# EAGLE design esp8266-proto-board-0805 (EAGLE 7.7.0)
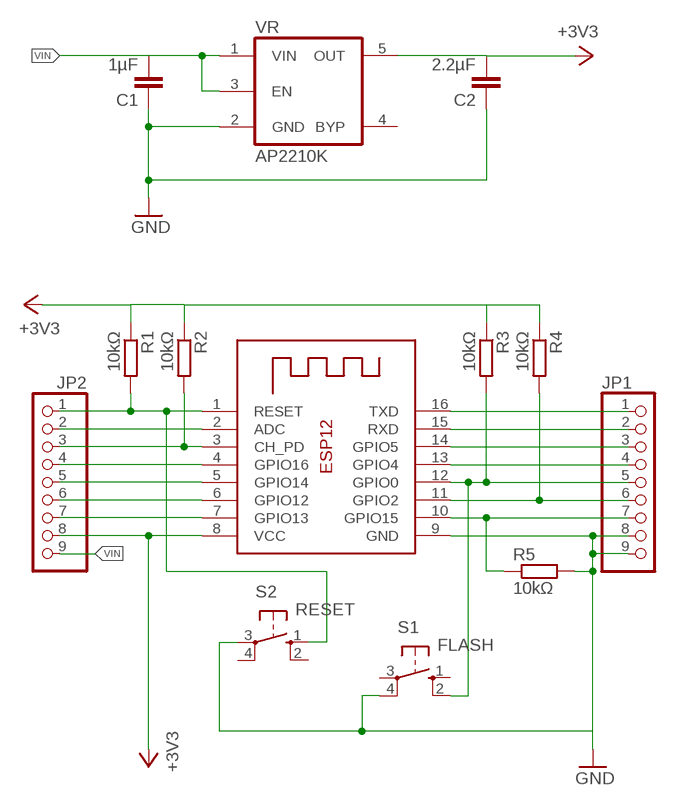
[diagram p0: schematic, sheet 1]

## Parts
C1  1µF  C-EUC0805K  [C0805K]
C2  2.2µF  C-EUC0805K  [C0805K]
JP1  PINHD-1X9  [1X09-BIG]
JP2  PINHD-1X9  [1X09-BIG]
R1  10kΩ  R-EU_R0805W  [R0805W]
R2  10kΩ  R-EU_R0805W  [R0805W]
R3  10kΩ  R-EU_R0805W  [R0805W]
R4  10kΩ  R-EU_R0805W  [R0805W]
R5  10kΩ  R-EU_R0805W  [R0805W]
S1  FLASH  10-XX  [B3F-10XX]
S2  RESET  10-XX  [B3F-10XX]
U1  ESP-12  [ESP-12]
VR  AP2210K  [SOT23-5]

## Nets
+3V3: C2.2 JP2.8 R1.1 R2.1 R3.1 R4.1 U1.8(VCC) VR.5(OUT)
ADC: JP2.2 U1.2(ADC)
CH_PD: JP2.3 R2.2 U1.3(CH_PD)
GND: C1.1 C2.1 JP1.8 JP1.9 R5.2 S1.4(P1) S2.3(P) U1.9(GND) VR.2(GND)
GPIO0: JP1.5 R3.2 S1.2(S1) U1.12(GPIO0)
GPIO2: JP1.6 R4.2 U1.11(GPIO2)
GPIO4: JP1.4 U1.13(GPIO4)
GPIO5: JP1.3 U1.14(GPIO5)
GPIO12: JP2.6 U1.6(GPIO12)
GPIO13: JP2.7 U1.7(GPIO13)
GPIO14: JP2.5 U1.5(GPIO14)
GPIO15: JP1.7 R5.1 U1.10(GPIO15)
GPIO16: JP2.4 U1.4(GPIO16)
RST: JP2.1 R1.2 S2.1(S) U1.1(RESET)
RX: JP1.2 U1.15(RXD)
TX: JP1.1 U1.16(TXD)
VIN: C1.2 JP2.9 VR.1(VIN) VR.3(EN)
Unconnected: S1.1(S) S1.3(P) S2.2(S1) S2.4(P1) VR.4(BYP)

## Library data of the parts
C1 C2 = rcl:C-EU: CAPACITOR, European symbol
JP1 JP2 = adafruit:PINHD-1X9: Pin header 1x10 0.1" spacing With round pins
R1-R5 = rcl:R-EU_: RESISTOR, European symbol
S1 S2 = switch-omron:10-XX: OMRON SWITCH; MPN: B3F-1000; OC_FARNELL: 176432; OC_NEWARK: 36M3542
U1 = adafruit:ESP-12
VR = diodes-inc:AP2210: LDO REGULATOR

## Board
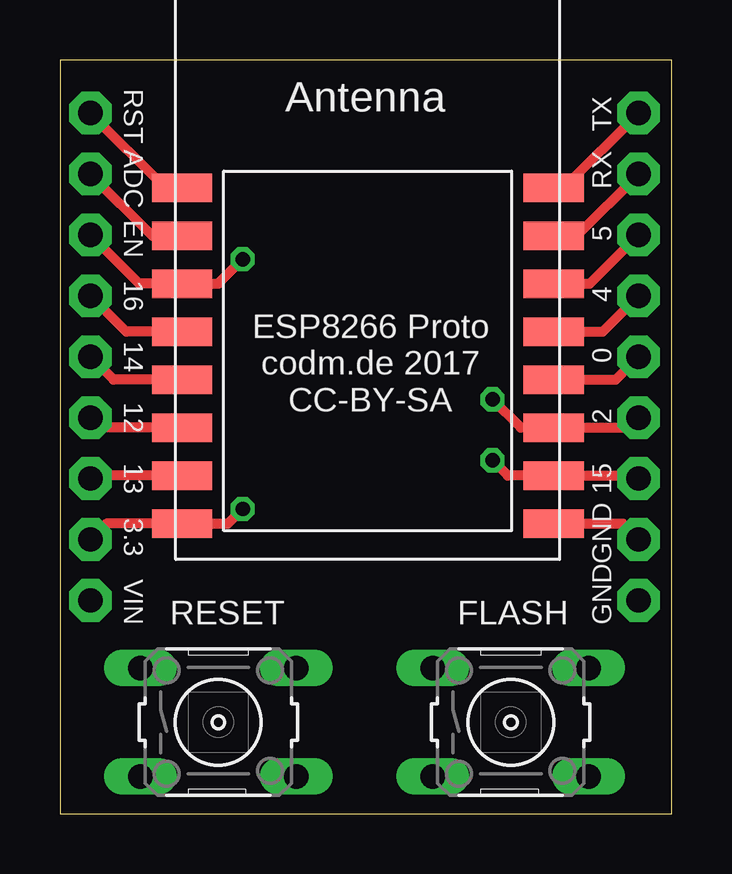
[diagram p1: board, top side]
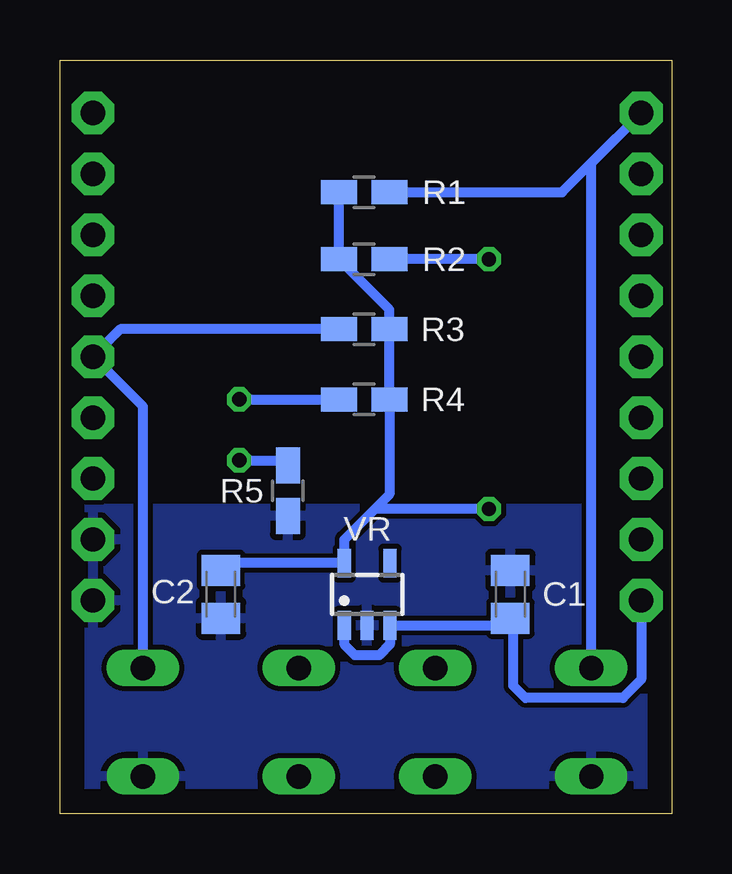
[diagram p2: board, bottom side, seen from below]

Size 25.51 x 31.42 mm. Coordinates in mm from the lower left corner, seen from the top.
Outline: 0,0 25.51,0 25.51,31.42 0,31.42 0,0
Copper layers (1*16): Top 0.035mm / dielectric 1.5mm / Bottom 0.035mm
Design rules "default": minimum track width 10mil, minimum drill 24mil, track to track 8mil, track to pad 8mil, pad to pad 8mil, via to via 8mil, smd to smd 8mil, copper to edge 40mil, drill to drill 8mil, minimum pad ring 10mil, minimum via ring 8mil, stop-mask expansion 4mil, vias tented up to drill 0mil, thermal gap 10mil

### Footprints (pad centres in the part's own frame; a part is rotated, then mirrored left to right if it is on the bottom)
C0805K = smd 1.3 x 1.6: 1 -1,0; 2 1,0
1X09-BIG = drill 1.016 pad 1.778 octagon: 1 -10.16,0; 2 -7.62,0; 3 -5.08,0; 4 -2.54,0; 5 0,0; 6 2.54,0; 7 5.08,0; 8 7.62,0; 9 10.16,0
R0805W = smd 1.5 x 1: 1 -1.052,0; 2 1.052,0
B3F-10XX = drill 1.016 long: 1 -3.251,2.261; 2 3.251,2.261; 3 -3.251,-2.261; 4 3.251,-2.261
ESP-12 = smd 2.508 x 1.2: 1 -7.729,4.5; 2 -7.729,2.5; 3 -7.729,0.5; 4 -7.729,-1.5; 5 -7.729,-3.5; 6 -7.729,-5.5; 7 -7.729,-7.5; 8 -7.729,-9.5; 9 7.754,-9.5; 10 7.754,-7.5; 11 7.754,-5.5; 12 7.754,-3.5; 13 7.754,-1.5; 14 7.754,0.5; 15 7.754,2.5; 16 7.754,4.5
SOT23-5 = smd 0.55 x 1.2: 1 -0.95,-1.3; 2 0,-1.3; 3 0.95,-1.3; 4 0.95,1.3; 5 -0.95,1.3

### Placement (x,y rotation side)
C1  6.73,9.14 270 bottom
C2  18.8,9.14 90 bottom
JP1  24.13,19.05 270 top
JP2  1.27,19.05 270 top
R1  12.83,25.91 0 bottom
R2  12.83,23.11 0 bottom
R3  12.83,20.19 180 bottom
R4  12.83,17.27 180 bottom
R5  16,13.46 270 bottom
S1  18.8,3.81 0 top
S2  6.6,3.81 0 top
U1  12.83,21.59 0 top
VR  12.7,9.14 0 bottom

### Tracks (layer width: path | path; a pad name or v marks a point on that pad's centre or on a via)
+3V3  (via drill 0.6)
  Top 0.406: JP2.8 1.93,12.09 U1.8 7.01,12.09 v7.62,12.7
  Bottom 0.406: R1.1 R2.1 11.77,21.01 R3.1 R4.1 11.77,13.31 12.38,12.7 | 12.38,12.7 13.65,11.43 VR.5 18.5,10.44 C2.2 | v7.62,12.7 12.38,12.7
ADC
  Top 0.406: U1.2 3.85,24.09 JP2.2
CH_PD  (via drill 0.6)
  Top 0.406: JP2.3 3.31,22.09 U1.3 6.6,22.09 v7.62,23.11
  Bottom 0.406: v7.62,23.11 R2.2
GND
  Top 0.406: U1.9 23.47,12.09 JP1.8
  pour Bottom: 0,12.7 25.4,12.7 25.4,0 0,0
GPIO0
  Top 0.406: U1.12 23.17,18.09 JP1.5
  Bottom 0.406: R3.2 22.99,20.19 JP1.5 22.05,16.97 S1.2
GPIO2  (via drill 0.6)
  Top 0.406: JP1.6 23.71,16.09 U1.11 19.22,16.09 v18.03,17.27
  Bottom 0.406: v18.03,17.27 R4.2
GPIO4
  Top 0.406: U1.13 22.63,20.09 JP1.4
GPIO5
  Top 0.406: U1.14 22.09,22.09 JP1.3
GPIO12
  Top 0.406: U1.6 1.69,16.09 JP2.6
GPIO13
  Top 0.406: U1.7 1.39,14.09 JP2.7
GPIO14
  Top 0.406: U1.5 2.23,18.09 JP2.5
GPIO15  (via drill 0.6)
  Top 0.406: JP1.7 24.01,14.09 U1.10 18.68,14.09 v18.03,14.73
  Bottom 0.406: v18.03,14.73 16.22,14.73 R5.1
GPIO16
  Top 0.406: U1.4 2.77,20.09 JP2.4
RST
  Top 0.406: U1.1 4.39,26.09 JP2.1
  Bottom 0.406: 3.3,27.18 JP2.1 | S2.1 3.35,27.13 JP2.1 | R1.2 4.57,25.91 JP2.1
RX
  Top 0.406: U1.15 21.55,24.09 JP1.2
TX
  Top 0.406: U1.16 21.01,26.09 JP1.1
VIN
  Bottom 0.406: VR.1 13.64,7.04 13.21,6.6 12.19,6.6 11.75,7.05 VR.3 6.83,7.84 6.6,7.62 | JP2.9 1.27,5.59 2.03,4.83 6.1,4.83 6.6,5.33 6.6,7.62 | 6.6,7.62 6.6,8.02 C1.2

### Text on the board
tNames: RST | ADC | TX | RX | EN | 5 | 16 | 4 | 14 | ESP8266 Proto / codm.de 2017 / CC-BY-SA | 0 | 12 | 2 | 13 | 15 | 3.3 | VIN | GND | GND